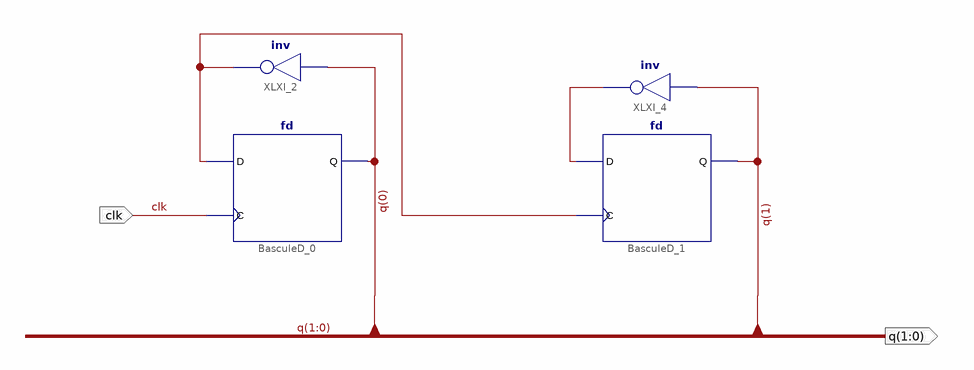
[diagram p0: schematic sheet 1]
// Xilinx ISE schematic compteur4.sch (spartan3e) as structural Verilog: 4 symbols, 2 ports
module compteur4 (
  input  clk,
  output [1:0] q
);

  wire XLXN_2, XLXN_4;

  fd BasculeD_0 (.C(clk), .D(XLXN_2), .Q(q[0]));
  not XLXI_2 (XLXN_2, q[0]);
  fd BasculeD_1 (.C(XLXN_2), .D(XLXN_4), .Q(q[1]));
  not XLXI_4 (XLXN_4, q[1]);
endmodule
